# Altium schematic sheet Drive_Module.SchDoc
size B
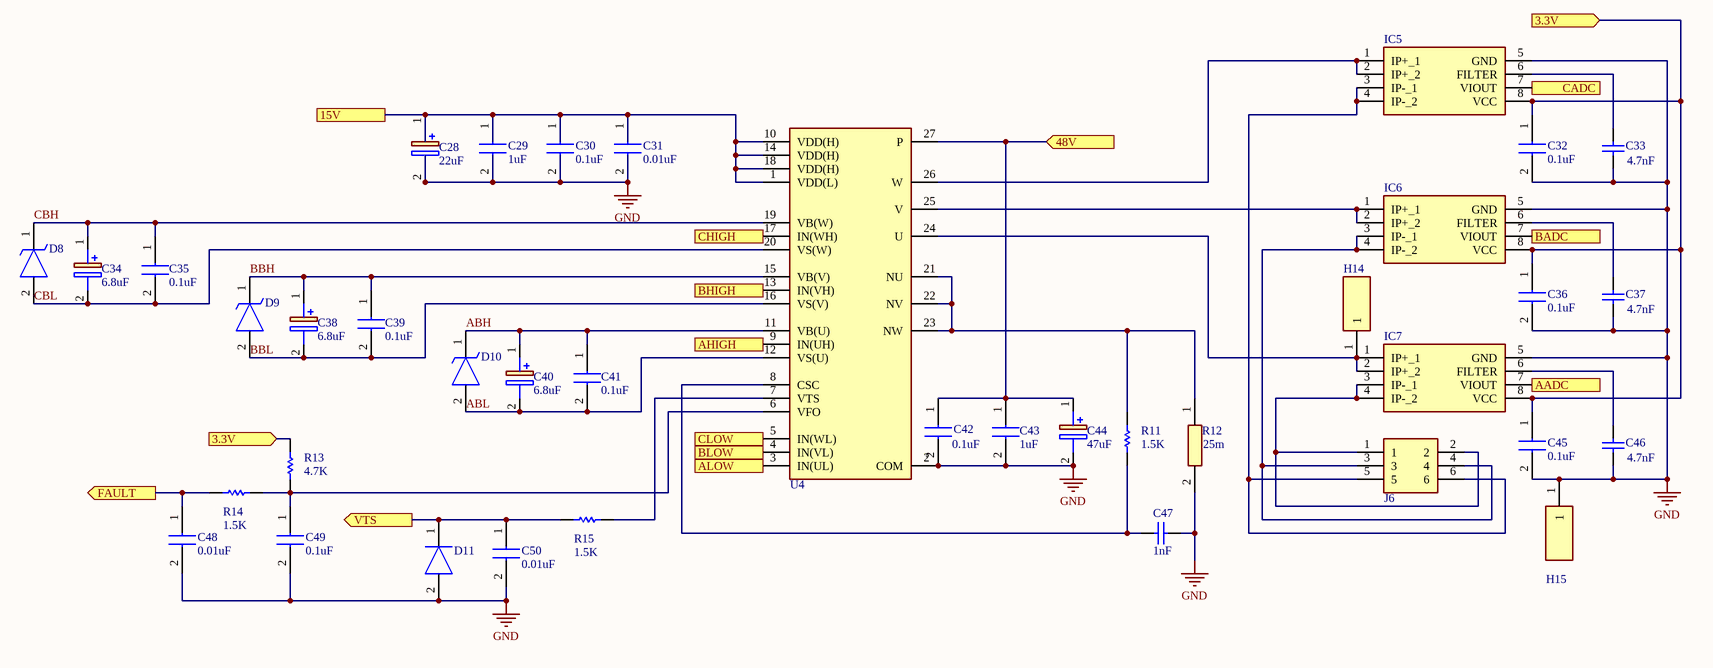
[diagram p0: Drive_Module.SchDoc]

## Parts
C28  value 22uF  [CAPPRD200W50D550H1250]  (hidden comment: UPW1E220MDD)
C29  value 1uF  [C330C105K5R5TA]  (hidden comment: C330C105K5R5TA)
C30  value 0.1uF  [K104K10X7RF5UH5]  (hidden comment: K104K10X7RF5UH5)
C31  value 0.01uF  [C315C103K5R5TA7990]  (hidden comment: C315C103K5R5TA7990)
C32  value 0.1uF  [CAPC1608X95N]  (hidden comment: C0603C104K5RAC3121)
C33  value 4.7nF  [CAPC1608X90X35ML10T15]  (hidden comment: GRM188R71H472KA01D)
C34  6.8uF  [CAPPRD150W45D425H1250]
C35  value 0.1uF  [K104K10X7RF5UH5]  (hidden comment: K104K10X7RF5UH5)
C36  value 0.1uF  [CAPC1608X95N]  (hidden comment: C0603C104K5RAC3121)
C37  value 4.7nF  [CAPC1608X90X35ML10T15]  (hidden comment: GRM188R71H472KA01D)
C38  6.8uF  [CAPPRD150W45D425H1250]
C39  value 0.1uF  [K104K10X7RF5UH5]  (hidden comment: K104K10X7RF5UH5)
C40  6.8uF  [CAPPRD150W45D425H1250]
C41  value 0.1uF  [K104K10X7RF5UH5]  (hidden comment: K104K10X7RF5UH5)
C42  value 0.1uF  [CAPC1608X90N]  (hidden comment: GRM188R72A104MA35D)
C43  value 1uF  [RCE5C1H104J2A2H03B]  (hidden comment: RDER72A105K2M1H03A)
C44  value 47uF  [CAPPRD350W65D800H1650]  (hidden comment: EEU-FS2A470)
C45  value 0.1uF  [CAPC1608X95N]  (hidden comment: C0603C104K5RAC3121)
C46  value 4.7nF  [CAPC1608X90X35ML10T15]  (hidden comment: GRM188R71H472KA01D)
C47  1nF  [CAPC2013X95X45NL10T25]
C48  value 0.01uF  [C315C103K5R5TA7990]  (hidden comment: C315C103K5R5TA7990)
C49  value 0.1uF  [K104K10X7RF5UH5]  (hidden comment: K104K10X7RF5UH5)
C50  value 0.01uF  [C315C103K5R5TA7990]  (hidden comment: C315C103K5R5TA7990)
D8  P6KE91A-E3_54  [DIOAD1910W86L670D310]  (value not drawn)
D9  P6KE91A-E3_54  [DIOAD1910W86L670D310]  (value not drawn)
D10  P6KE91A-E3_54  [DIOAD1910W86L670D310]  (value not drawn)
D11  BZX584C3V3-G3-08  [SODFL1608X75N]  (value not drawn)
H14  5003  [5003]  (value not drawn)
H15  5003  [5003]  (value not drawn)
IC5  ACS725LLCTR-20AB-T  [SOT127P600X175-8N]  (value not drawn)
IC6  ACS725LLCTR-20AB-T  [SOT127P600X175-8N]  (value not drawn)
IC7  ACS725LLCTR-20AB-T  [SOT127P600X175-8N]  (value not drawn)
J6  1730515  [1730515]  (value not drawn)
R11  value 1.5K  [AXIAL-0.3]  (hidden comment: Res1)
R12  value 25m  [RESC7146X175N]  (hidden comment: WSHP2818R0500FEA)
R13  value 4.7K  [AXIAL-0.3]  (hidden comment: Res1)
R14  value 1.5K  [AXIAL-0.3]  (hidden comment: Res1)
R15  value 1.5K  [AXIAL-0.3]  (hidden comment: Res1)
U4  FNB34060T  [FNB34060T]  (value not drawn)

## Ports
3.3V (in), 15V, 48V (in), AADC (out), AHIGH (in), ALOW (in), BADC (out), BHIGH (in), BLOW (in), CADC (out), CHIGH (in), CLOW (in), FAULT (out), VTS (out)

## Nets
GND: C28.2(-) C29.2 C30.2 C31.2 C32.2 C33.2 C36.2 C37.2 C42.2 C43.2 C44.2(-) C45.2 C46.2 C47.2 C48.2 C49.2 C50.2 D11.2(A) H15.1 IC5.5(GND) IC6.5(GND) IC7.5(GND) R12.2 U4.2(COM)
3.3V: C32.1 C36.1 C45.1 IC5.8(VCC) IC6.8(VCC) IC7.8(VCC) R13.2 ; port 3.3V
15V: C28.1(+) C29.1 C30.1 C31.1 U4.1(VDD(L)) U4.10(VDD(H)) U4.14(VDD(H)) U4.18(VDD(H)) ; port 15V
48V: C42.1 C43.1 C44.1(+) U4.27(P) ; port 48V
AADC: IC7.7(VIOUT) ; port AADC
ABH: C40.1(+) C41.1 D10.1(K) U4.11(VB(U))
ABL: C40.2(-) C41.2 D10.2(A) U4.12(VS(U))
AHIGH: U4.9(IN(UH)) ; port AHIGH
ALOW: U4.3(IN(UL)) ; port ALOW
BADC: IC6.7(VIOUT) ; port BADC
BBH: C38.1(+) C39.1 D9.1(K) U4.15(VB(V))
BBL: C38.2(-) C39.2 D9.2(A) U4.16(VS(V))
BHIGH: U4.13(IN(VH)) ; port BHIGH
BLOW: U4.4(IN(VL)) ; port BLOW
CADC: IC5.7(VIOUT) ; port CADC
CBH: C34.1(+) C35.1 D8.1(K) U4.19(VB(W))
CBL: C34.2(-) C35.2 D8.2(A) U4.20(VS(W))
CHIGH: U4.17(IN(WH)) ; port CHIGH
CLOW: U4.5(IN(WL)) ; port CLOW
FAULT: C48.1 R14.1 ; port FAULT
VTS: C50.1 D11.1(K) R15.2 ; port VTS
NetC33_1: C33.1 IC5.6(FILTER)
NetC37_1: C37.1 IC6.6(FILTER)
NetC46_1: C46.1 IC7.6(FILTER)
NetC47_1: C47.1 R11.1 U4.8(CSC)
NetC49_1: C49.1 R13.1 R14.2 U4.6(VFO)
NetH14_1: H14.1 IC7.1(IP+_1) IC7.2(IP+_2) U4.24(U)
NetIC5_1: IC5.1(IP+_1) IC5.2(IP+_2) U4.26(W)
NetIC5_3: IC5.3(IP-_1) IC5.4(IP-_2) J6.5 J6.6
NetIC6_1: IC6.1(IP+_1) IC6.2(IP+_2) U4.25(V)
NetIC6_3: IC6.3(IP-_1) IC6.4(IP-_2) J6.3 J6.4
NetIC7_3: IC7.3(IP-_1) IC7.4(IP-_2) J6.1 J6.2
NetR11_2: R11.2 R12.1 U4.21(NU) U4.22(NV) U4.23(NW)
NetR15_1: R15.1 U4.7(VTS)

## Library data of the parts
C28 = UPW1E220MDD: Capacitor Polarised  25V; Manufacturer_Name: Nichicon; Allied_Number: 70187288; Datasheet Link: http://nichicon-us.com/english/products/pdfs/e-upw.pdf; Height: 12.5mm; Manufacturer_Part_Number: UPW1E220MDD; Mouser Part Number: 647-UPW1E220MDD; Mouser Price/Stock: https://www.mouser.com/Search/Refine.aspx?Keyword=647-UPW1E220MDD; RS Part Number: 7152625P; RS Price/Stock: http://uk.rs-online.com/web/p/products/7152625P; Allied Price/Stock: https://www.alliedelec.com/nichicon-upw1e220mdd/70187288/
C29 = C330C105K5R5TA: Capacitor 50V; Manufacturer_Name: Kemet; Datasheet Link: http://uk.rs-online.com/web/p/products/8704038; Height: 9mm; Manufacturer_Part_Number: C330C105K5R5TA; Mouser Part Number: 80-C330C105K5R; Mouser Price/Stock: https://www.mouser.com/Search/Refine.aspx?Keyword=80-C330C105K5R; RS Part Number: 8704038; RS Price/Stock: http://uk.rs-online.com/web/p/products/8704038
C30 C35 C39 C41 C49 = K104K10X7RF5UH5: Capacitor 50V; Manufacturer_Name: Vishay; Datasheet Link: https://www.vishay.com/docs/45171/kseries.pdf; Height: 6.2mm; Manufacturer_Part_Number: K104K10X7RF5UH5; Mouser Part Number: 594-K104K10X7RF5UH5; Mouser Price/Stock: https://www.mouser.com/Search/Refine.aspx?Keyword=594-K104K10X7RF5UH5
C31 C48 C50 = C315C103K5R5TA7990: Capacitor 50V; Manufacturer_Name: Kemet; Datasheet Link: https://api.kemet.com/component-edge/download/datasheet/C315C103K5R5TA.pdf; Height: 4.66mm; Manufacturer_Part_Number: C315C103K5R5TA7990; Mouser Part Number: N/A; Mouser Price/Stock: https://www.mouser.com/Search/Refine.aspx?Keyword=N%2FA
C32 C36 C45 = C0603C104K5RAC3121: Capacitor 50V; Manufacturer_Name: Kemet; Datasheet Link: https://mouser.componentsearchengine.com/Datasheets/1/C0603C104K5RAC3121.pdf; Height: 0.95mm; Manufacturer_Part_Number: C0603C104K5RAC3121; Mouser Part Number: 80-C603C104K5RAC3121; Mouser Price/Stock: https://www.mouser.com/Search/Refine.aspx?Keyword=80-C603C104K5RAC3121
C33 C37 C46 = CMP-2006-02924-1: Manufacturer: Murata; Part Number: GRM188R71H472KA01D
C34 C38 = UPW1J6R8MDD6: Capacitor Polarised; Manufacturer_Name: Nichicon; Allied_Number: 70187297; Datasheet Link: http://nichicon-us.com/english/products/pdfs/e-upw.pdf; Height: 12.5mm; Manufacturer_Part_Number: UPW1J6R8MDD6; RS Part Number: 8515424; RS Price/Stock: https://uk.rs-online.com/web/p/products/8515424; Allied Price/Stock: https://www.alliedelec.com/nichicon-upw1j6r8mdd6/70187297/
C40 = UPW1J6R8MDD6: Manufacturer_Name: Nichicon; Allied_Number: 70187297; Datasheet Link: http://nichicon-us.com/english/products/pdfs/e-upw.pdf; Height: 12.5mm; Manufacturer_Part_Number: UPW1J6R8MDD6; RS Part Number: 8515424; RS Price/Stock: https://uk.rs-online.com/web/p/products/8515424; Allied Price/Stock: https://www.alliedelec.com/nichicon-upw1j6r8mdd6/70187297/
C42 = GRM188R72A104MA35D: Capacitor; Manufacturer_Name: Murata Electronics; Height: 0.9mm; Manufacturer_Part_Number: GRM188R72A104MA35D; Mouser Part Number: 81-GRM188R72A104MA5D; Mouser Price/Stock: https://www.mouser.com/Search/Refine.aspx?Keyword=81-GRM188R72A104MA5D
C43 = RDER72A105K2M1H03A: Capacitor; Manufacturer_Name: Murata Electronics; Datasheet Link: https://psearch.en.murata.com/capacitor/product/RDER72A105K2M1H03A.html; Height: 5.5mm; Manufacturer_Part_Number: RDER72A105K2M1H03A; Mouser Part Number: 81-RDER72A105K2M1H3A; Mouser Price/Stock: https://www.mouser.com/Search/Refine.aspx?Keyword=81-RDER72A105K2M1H3A; RS Part Number: 1504005; RS Price/Stock: http://uk.rs-online.com/web/p/products/1504005
C44 = EEU-FS2A470: Capacitor Polarised; Manufacturer_Name: Panasonic; Datasheet Link: https://componentsearchengine.com/Datasheets/1/EEU-FS2A470.pdf; Height: 16.5mm; Manufacturer_Part_Number: EEU-FS2A470; Mouser Part Number: 667-EEU-FS2A470; Mouser Price/Stock: https://www.mouser.com/Search/Refine.aspx?Keyword=667-EEU-FS2A470
C47 = CMP-2007-00148-1: GRM2195C2A102JA01D; Manufacturer: Murata; Part Number: GRM2195C2A102JA01D
D8-D10 = P6KE91A-E3_54: TVS Diode (Uni-directional); Manufacturer_Name: Vishay; Manufacturer_Part_Number: P6KE91A-E3/54; Datasheet Link: https://www.mouser.com/datasheet/2/427/p6ke-1767850.pdf
D11 = BZX584C3V3-G3-08: Diode; Manufacturer_Name: Vishay; Datasheet Link: https://componentsearchengine.com/Datasheets/1/BZX584C3V3-G3-08.pdf; Height: 0.75mm; Manufacturer_Part_Number: BZX584C3V3-G3-08; Mouser Part Number: 78-BZX584C3V3-G3-08; Mouser Price/Stock: https://www.mouser.com/Search/Refine.aspx?Keyword=78-BZX584C3V3-G3-08
H14 H15 = 5003: Hardware; Manufacturer_Name: Keystone Electronics; Allied_Number: 70799414; Datasheet Link: https://componentsearchengine.com/Datasheets/1/5003.pdf; Height: 4.57mm; Manufacturer_Part_Number: 5003; Mouser Part Number: 534-5003; Mouser Price/Stock: https://www.mouser.com/Search/Refine.aspx?Keyword=534-5003; Allied Price/Stock: https://www.alliedelec.com/keystoneelectronics-5003/70799414/
IC5-IC7 = ACS725LLCTR-20AB-T: Integrated Circuit; Manufacturer_Name: Allegro Microsystems; Datasheet Link: https://www.allegromicro.com/~/media/Files/Datasheets/ACS725-Datasheet.ashx; Height: 1.75mm; Manufacturer_Part_Number: ACS725LLCTR-20AB-T
J6 = 1730515: Connector; Manufacturer_Name: Phoenix Contact; Allied_Number: 71065041; Datasheet Link: https://media.digikey.com/PDF/Data%20Sheets/Phoenix%20Contact%20PDFs/1730515.pdf; Height: 18mm; Manufacturer_Part_Number: 1730515; Mouser Part Number: 651-1730515; Mouser Price/Stock: https://www.mouser.com/Search/Refine.aspx?Keyword=651-1730515; Allied Price/Stock: https://www.alliedelec.com/phoenixcontact-1730515/71065041/
R11 R13-R15 = Res1: Resistor; Published: 8-Jun-2000; LatestRevisionDate: 17-Jul-2002; LatestRevisionNote: Re-released for DXP Platform.; PackageReference: AXIAL-0.3; Publisher: Altium Limited; PackageDescription: Axial Device, Thru-Hole; 2 Leads; 0.3 in Pin Spacing
R12 = WSHP2818R0500FEA: Resistor; Manufacturer_Name: Vishay; Datasheet Link: https://www.vishay.com/docs/30347/wshp2818.pdf; Height: 1.75mm; Manufacturer_Part_Number: WSHP2818R0500FEA; Mouser Part Number: 71-WSHP2818R0500FEA; Mouser Price/Stock: https://www.mouser.com/Search/Refine.aspx?Keyword=71-WSHP2818R0500FEA